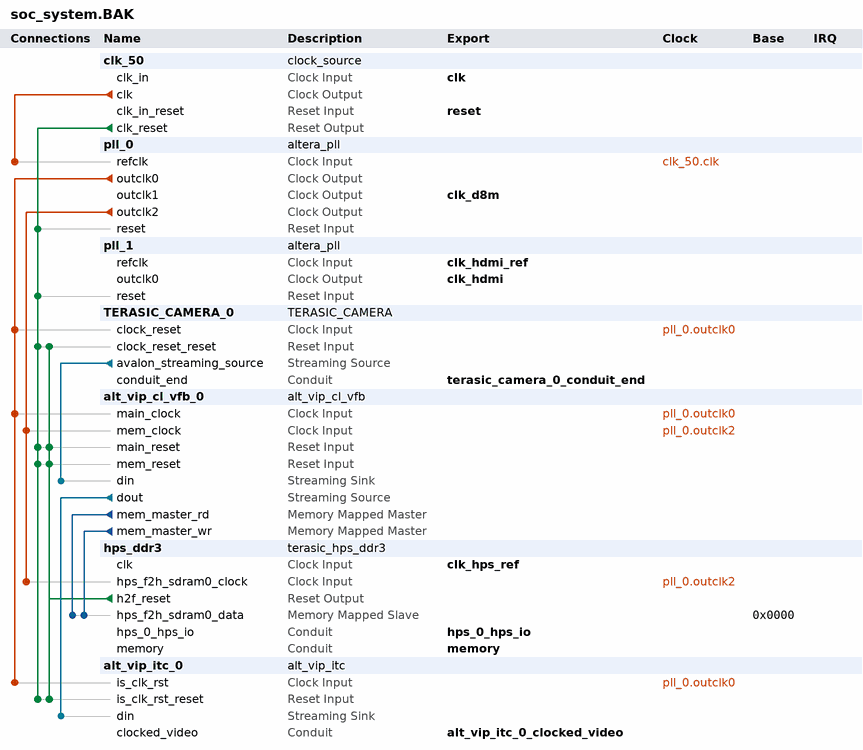
[diagram p0: system contents]
# Platform Designer (Qsys) system soc_system.BAK, Cyclone V 5CSEBA6U23I7
# Parameters at their usual value, and those the tool derives, are not listed.
package require -exact qsys 16.0
create_system soc_system.BAK
set_project_property DEVICE_FAMILY {Cyclone V}
set_project_property DEVICE 5CSEBA6U23I7

add_instance clk_50 clock_source 16.0
set_instance_parameter_value clk_50 clockFrequency 50000000

add_instance pll_0 altera_pll 16.0
set_instance_parameter_value pll_0 gui_device_speed_grade 2
set_instance_parameter_value pll_0 gui_number_of_clocks 3
set_instance_parameter_value pll_0 gui_operation_mode direct
set_instance_parameter_value pll_0 gui_output_clock_frequency0 160.0
set_instance_parameter_value pll_0 gui_output_clock_frequency1 20.0
set_instance_parameter_value pll_0 gui_output_clock_frequency2 100.0
set_instance_parameter_value pll_0 gui_pll_mode {Integer-N PLL}
set_instance_parameter_value pll_0 gui_reference_clock_frequency 50.0
set_instance_parameter_value pll_0 gui_use_locked false

add_instance pll_1 altera_pll 16.0
set_instance_parameter_value pll_1 gui_device_speed_grade 2
set_instance_parameter_value pll_1 gui_number_of_clocks 1
set_instance_parameter_value pll_1 gui_operation_mode direct
set_instance_parameter_value pll_1 gui_output_clock_frequency0 148.5
set_instance_parameter_value pll_1 gui_pll_mode {Fractional-N PLL}
set_instance_parameter_value pll_1 gui_reference_clock_frequency 50.0
set_instance_parameter_value pll_1 gui_use_locked false

add_instance TERASIC_CAMERA_0 TERASIC_CAMERA 1.0
set_instance_parameter_value TERASIC_CAMERA_0 VIDEO_H 1080
set_instance_parameter_value TERASIC_CAMERA_0 VIDEO_W 1920

add_instance alt_vip_cl_vfb_0 alt_vip_cl_vfb 16.0
set_instance_parameter_value alt_vip_cl_vfb_0 CLOCKS_ARE_SEPARATE 1
set_instance_parameter_value alt_vip_cl_vfb_0 DROP_FRAMES 1
set_instance_parameter_value alt_vip_cl_vfb_0 DROP_REPEAT_USER 0
set_instance_parameter_value alt_vip_cl_vfb_0 IS_FRAME_READER 0
set_instance_parameter_value alt_vip_cl_vfb_0 MAX_HEIGHT 1080
set_instance_parameter_value alt_vip_cl_vfb_0 MAX_WIDTH 1920
set_instance_parameter_value alt_vip_cl_vfb_0 MEM_BASE_ADDR 0
set_instance_parameter_value alt_vip_cl_vfb_0 MEM_BUFFER_OFFSET 16777216
set_instance_parameter_value alt_vip_cl_vfb_0 MEM_PORT_WIDTH 128
set_instance_parameter_value alt_vip_cl_vfb_0 READER_RUNTIME_CONTROL 0
set_instance_parameter_value alt_vip_cl_vfb_0 READ_BURST_TARGET 64
set_instance_parameter_value alt_vip_cl_vfb_0 READ_FIFO_DEPTH 512
set_instance_parameter_value alt_vip_cl_vfb_0 USER_PACKETS_MAX_STORAGE 1
set_instance_parameter_value alt_vip_cl_vfb_0 USE_BUFFER_OFFSET 0
set_instance_parameter_value alt_vip_cl_vfb_0 WRITE_BURST_TARGET 64
set_instance_parameter_value alt_vip_cl_vfb_0 WRITE_FIFO_DEPTH 512

add_instance hps_ddr3 terasic_hps_ddr3 1.0

add_instance alt_vip_itc_0 alt_vip_itc 14.0
set_instance_parameter_value alt_vip_itc_0 FIFO_DEPTH 7680
set_instance_parameter_value alt_vip_itc_0 H_ACTIVE_PIXELS 1920
set_instance_parameter_value alt_vip_itc_0 H_BACK_PORCH 148
set_instance_parameter_value alt_vip_itc_0 H_FRONT_PORCH 88
set_instance_parameter_value alt_vip_itc_0 H_SYNC_LENGTH 44
set_instance_parameter_value alt_vip_itc_0 NUMBER_OF_COLOUR_PLANES 3
set_instance_parameter_value alt_vip_itc_0 THRESHOLD 1919
set_instance_parameter_value alt_vip_itc_0 V_ACTIVE_LINES 1080
set_instance_parameter_value alt_vip_itc_0 V_BACK_PORCH 36
set_instance_parameter_value alt_vip_itc_0 V_FRONT_PORCH 4
set_instance_parameter_value alt_vip_itc_0 V_SYNC_LENGTH 5

# connections
add_connection clk_50.clk pll_0.refclk clock
add_connection pll_0.outclk0 alt_vip_cl_vfb_0.main_clock clock
add_connection pll_0.outclk0 alt_vip_itc_0.is_clk_rst clock
add_connection pll_0.outclk0 TERASIC_CAMERA_0.clock_reset clock
add_connection pll_0.outclk2 alt_vip_cl_vfb_0.mem_clock clock
add_connection pll_0.outclk2 hps_ddr3.hps_f2h_sdram0_clock clock
add_connection clk_50.clk_reset alt_vip_cl_vfb_0.main_reset reset
add_connection clk_50.clk_reset alt_vip_cl_vfb_0.mem_reset reset
add_connection clk_50.clk_reset alt_vip_itc_0.is_clk_rst_reset reset
add_connection clk_50.clk_reset pll_0.reset reset
add_connection clk_50.clk_reset pll_1.reset reset
add_connection clk_50.clk_reset TERASIC_CAMERA_0.clock_reset_reset reset
add_connection hps_ddr3.h2f_reset alt_vip_cl_vfb_0.main_reset reset
add_connection hps_ddr3.h2f_reset alt_vip_cl_vfb_0.mem_reset reset
add_connection hps_ddr3.h2f_reset alt_vip_itc_0.is_clk_rst_reset reset
add_connection hps_ddr3.h2f_reset TERASIC_CAMERA_0.clock_reset_reset reset
add_connection alt_vip_cl_vfb_0.mem_master_rd hps_ddr3.hps_f2h_sdram0_data avalon
set_connection_parameter_value alt_vip_cl_vfb_0.mem_master_rd/hps_ddr3.hps_f2h_sdram0_data baseAddress 0x0000
add_connection alt_vip_cl_vfb_0.mem_master_wr hps_ddr3.hps_f2h_sdram0_data avalon
set_connection_parameter_value alt_vip_cl_vfb_0.mem_master_wr/hps_ddr3.hps_f2h_sdram0_data baseAddress 0x0000
add_connection alt_vip_cl_vfb_0.dout alt_vip_itc_0.din avalon_streaming
add_connection TERASIC_CAMERA_0.avalon_streaming_source alt_vip_cl_vfb_0.din avalon_streaming

# exported interfaces
add_interface alt_vip_itc_0_clocked_video conduit end
set_interface_property alt_vip_itc_0_clocked_video EXPORT_OF alt_vip_itc_0.clocked_video
add_interface clk clock sink
set_interface_property clk EXPORT_OF clk_50.clk_in
add_interface clk_d8m clock source
set_interface_property clk_d8m EXPORT_OF pll_0.outclk1
add_interface clk_hdmi clock source
set_interface_property clk_hdmi EXPORT_OF pll_1.outclk0
add_interface clk_hdmi_ref clock sink
set_interface_property clk_hdmi_ref EXPORT_OF pll_1.refclk
add_interface clk_hps_ref clock sink
set_interface_property clk_hps_ref EXPORT_OF hps_ddr3.clk
add_interface hps_0_hps_io conduit end
set_interface_property hps_0_hps_io EXPORT_OF hps_ddr3.hps_0_hps_io
add_interface memory conduit end
set_interface_property memory EXPORT_OF hps_ddr3.memory
add_interface reset reset sink
set_interface_property reset EXPORT_OF clk_50.clk_in_reset
add_interface terasic_camera_0_conduit_end conduit end
set_interface_property terasic_camera_0_conduit_end EXPORT_OF TERASIC_CAMERA_0.conduit_end

set_interconnect_requirement {$system} qsys_mm.clockCrossingAdapter HANDSHAKE
set_interconnect_requirement {$system} qsys_mm.maxAdditionalLatency 1

save_system soc_system.BAK.qsys
